# EAGLE schematic i2c-level-shifter (EAGLE 6.3)
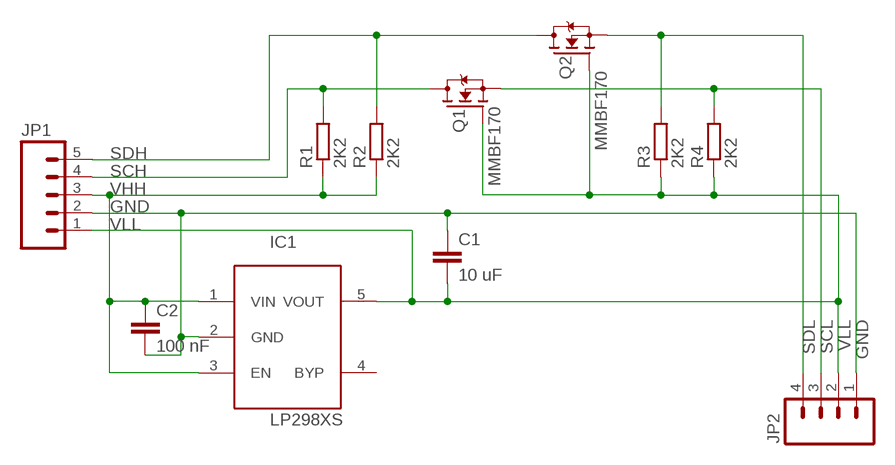
[diagram p0: schematic, sheet 1]

## Parts
C1  10 uF  C-EUC1206  [C1206]
C2  100 nF  C-EUC0805  [C0805]
IC1  LP298XS  [SOT23-5L]
JP1  M05PTH  [1X05]
JP2  M04PTH  [1X04]
Q1  MMBF170  TRANSISTOR_FET_BS170-SOT-23  [SOT-23]
Q2  MMBF170  TRANSISTOR_FET_BS170-SOT-23  [SOT-23]
R1  2K2  R-EU_R0603  [R0603]
R2  2K2  R-EU_R0603  [R0603]
R3  2K2  R-EU_R0603  [R0603]
R4  2K2  R-EU_R0603  [R0603]

## Nets
GND: C1.1 C2.2 IC1.2(GND) JP1.2 JP2.1
SCH: JP1.4 Q1.3(D) R1.2
SCL: JP2.4 Q2.2(S) R3.2
SDH: JP1.5 Q2.3(D) R2.2
SDL: JP2.3 Q1.2(S) R4.2
VHH: C2.1 IC1.1(VIN) IC1.3(EN) JP1.3 R1.1 R2.1
VLL: C1.2 IC1.5(VOUT) JP1.1 JP2.2 Q1.1(G) Q2.1(G) R3.1 R4.1
Unconnected: IC1.4(BYP)

## Library data of the parts
C1 C2 = rcl:C-EU: CAPACITOR, European symbol
IC1 = adafruit:LP298X
JP1 = SparkFun:M05: Header 5 Standard 5-pin 0.1" header. Use with straight break away headers (SKU : PRT-00116), right angle break away headers (PRT-00553), swiss pins (PRT-00743), machine pins (PRT-00117), and female headers (PRT-00115). Molex polarized connector foot print use with SKU : PRT-08230 with associated crimp pins and housings.
JP2 = SparkFun:M04: Header 4 Standard 4-pin 0.1" header. Use with straight break away headers (SKU : PRT-00116), right angle break away headers (PRT-00553), swiss pins (PRT-00743), machine pins (PRT-00117), and female headers (PRT-00115). Molex polarized connector foot print use with SKU : PRT-08231 with associated crimp pins and housings. 1MM SMD Version SKU: PRT-10208
Q1 Q2 = dp_devices:TRANSISTOR_FET_BS170: N-Channel Enhancement Mode Field Effect Transistor
R1-R4 = rcl:R-EU_: RESISTOR, European symbol